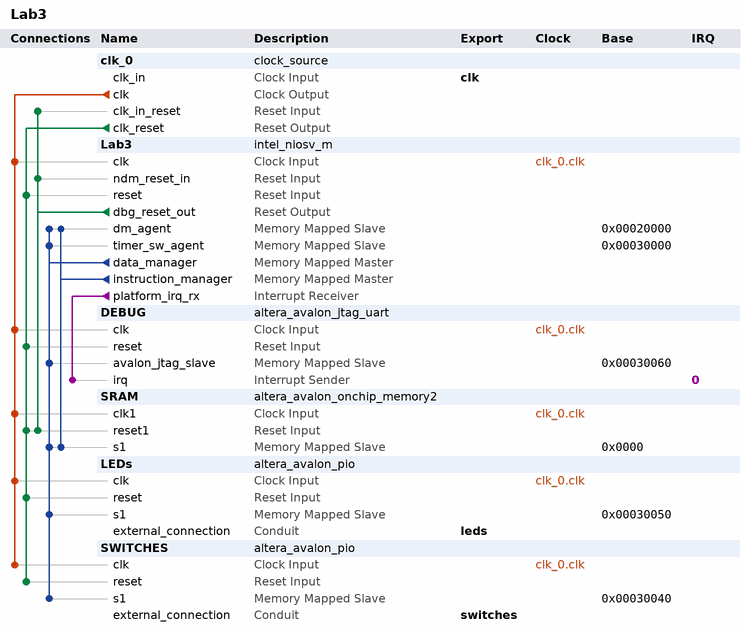
[diagram p0: system contents]
# Platform Designer (Qsys) system Lab3, Cyclone V 5CSXFC6D6F31C6
# Parameters at their usual value, and those the tool derives, are not listed.
package require -exact qsys 25.1
create_system Lab3
set_project_property DEVICE_FAMILY {Cyclone V}
set_project_property DEVICE 5CSXFC6D6F31C6

add_instance clk_0 clock_source 25.1
set_instance_parameter_value clk_0 clockFrequency 50000000

add_instance Lab3 intel_niosv_m 26.0.0
set_instance_parameter_value Lab3 enableAvalonInterface false
set_instance_parameter_value Lab3 enableDebugReset true
set_instance_parameter_value Lab3 enableECCFull false
set_instance_parameter_value Lab3 enableECCLite false
set_instance_parameter_value Lab3 hartId 0
set_instance_parameter_value Lab3 interruptMode 0
set_instance_parameter_value Lab3 pipelineArch true
set_instance_parameter_value Lab3 resetSlave SRAM.s1

add_instance DEBUG altera_avalon_jtag_uart 25.1
set_instance_parameter_value DEBUG simInteractiveOptions NO_INTERACTIVE_WINDOWS

add_instance SRAM altera_avalon_onchip_memory2 25.1
set_instance_parameter_value SRAM dataWidth 32
set_instance_parameter_value SRAM dualPort false
set_instance_parameter_value SRAM initMemContent true
set_instance_parameter_value SRAM initializationFileName onchip_mem.hex
set_instance_parameter_value SRAM memorySize 131072

add_instance LEDs altera_avalon_pio 25.1
set_instance_parameter_value LEDs direction Output
set_instance_parameter_value LEDs width 10

add_instance SWITCHES altera_avalon_pio 25.1
set_instance_parameter_value SWITCHES direction Input
set_instance_parameter_value SWITCHES width 10

# connections
add_connection clk_0.clk DEBUG.clk clock
add_connection clk_0.clk Lab3.clk clock
add_connection clk_0.clk LEDs.clk clock
add_connection clk_0.clk SRAM.clk1 clock
add_connection clk_0.clk SWITCHES.clk clock
add_connection clk_0.clk_reset DEBUG.reset reset
add_connection clk_0.clk_reset Lab3.reset reset
add_connection clk_0.clk_reset LEDs.reset reset
add_connection clk_0.clk_reset SRAM.reset1 reset
add_connection clk_0.clk_reset SWITCHES.reset reset
add_connection Lab3.dbg_reset_out clk_0.clk_in_reset reset
add_connection Lab3.dbg_reset_out Lab3.ndm_reset_in reset
add_connection Lab3.dbg_reset_out SRAM.reset1 reset
add_connection Lab3.data_manager DEBUG.avalon_jtag_slave avalon
set_connection_parameter_value Lab3.data_manager/DEBUG.avalon_jtag_slave baseAddress 0x00030060
add_connection Lab3.data_manager Lab3.dm_agent avalon
set_connection_parameter_value Lab3.data_manager/Lab3.dm_agent baseAddress 0x00020000
add_connection Lab3.data_manager Lab3.timer_sw_agent avalon
set_connection_parameter_value Lab3.data_manager/Lab3.timer_sw_agent baseAddress 0x00030000
add_connection Lab3.data_manager LEDs.s1 avalon
set_connection_parameter_value Lab3.data_manager/LEDs.s1 baseAddress 0x00030050
add_connection Lab3.data_manager SRAM.s1 avalon
set_connection_parameter_value Lab3.data_manager/SRAM.s1 baseAddress 0x0000
add_connection Lab3.data_manager SWITCHES.s1 avalon
set_connection_parameter_value Lab3.data_manager/SWITCHES.s1 baseAddress 0x00030040
add_connection Lab3.instruction_manager Lab3.dm_agent avalon
set_connection_parameter_value Lab3.instruction_manager/Lab3.dm_agent baseAddress 0x00020000
add_connection Lab3.instruction_manager SRAM.s1 avalon
set_connection_parameter_value Lab3.instruction_manager/SRAM.s1 baseAddress 0x0000
add_connection Lab3.platform_irq_rx DEBUG.irq interrupt
set_connection_parameter_value Lab3.platform_irq_rx/DEBUG.irq irqNumber 0

# exported interfaces
add_interface clk clock sink
set_interface_property clk EXPORT_OF clk_0.clk_in
add_interface leds conduit end
set_interface_property leds EXPORT_OF LEDs.external_connection
add_interface switches conduit end
set_interface_property switches EXPORT_OF SWITCHES.external_connection

set_interconnect_requirement {$system} qsys_mm.clockCrossingAdapter HANDSHAKE
set_interconnect_requirement {$system} qsys_mm.enableEccProtection FALSE
set_interconnect_requirement {$system} qsys_mm.insertDefaultSlave FALSE
set_interconnect_requirement {$system} qsys_mm.maxAdditionalLatency 1

save_system Lab3.qsys
